# Altium schematic sheet Master.SchDoc: Master
size A4; Revision: 01
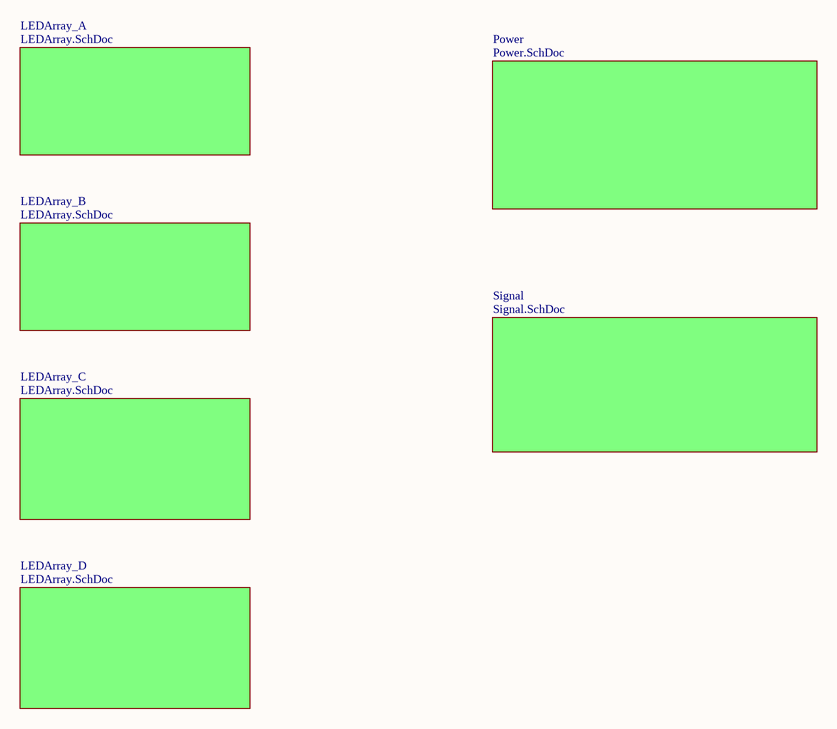
[diagram p0: Master.SchDoc]

## Sub-sheets
LEDArray_A = LEDArray.SchDoc: no entries
LEDArray_B = LEDArray.SchDoc: no entries
LEDArray_C = LEDArray.SchDoc: no entries
LEDArray_D = LEDArray.SchDoc: no entries
Power = Power.SchDoc: no entries
Signal = Signal.SchDoc: no entries

## Notes on the sheet
- Title
- Size:
- Date:
- A4
- Number:
- Time:
- Revision:
- Sheet
- of
- File: